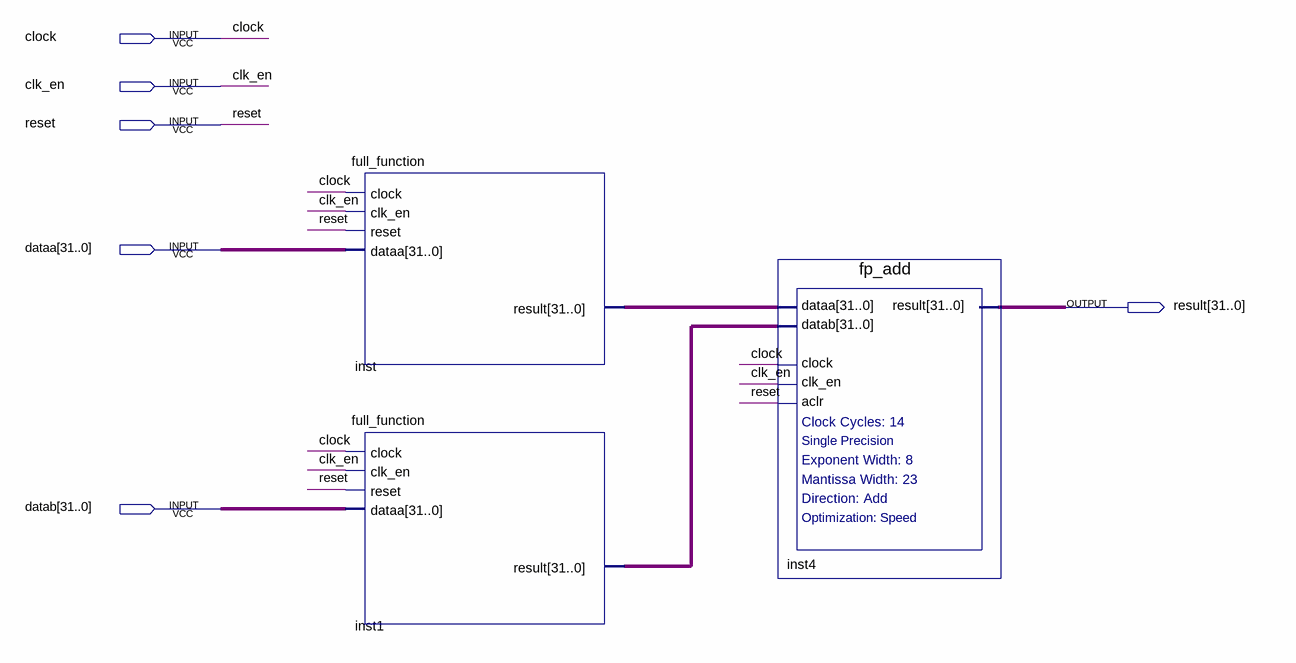
[diagram p0: schematic sheet]
// Quartus schematic parallel_hw.bdf as structural Verilog: 3 symbols, 6 pins
module parallel_hw (
  input  clock,
  input  clk_en,
  input  reset,
  input  [31:0] dataa,
  input  [31:0] datab,
  output [31:0] result
);

  wire [31:0] inst1_result, inst_result;

  full_function inst (.clk_en(clk_en), .clock(clock), .dataa(dataa), .reset(reset), .result(inst_result));
  full_function inst1 (.clk_en(clk_en), .clock(clock), .dataa(datab), .reset(reset), .result(inst1_result));
  fp_add inst4 (
    .dataa(inst_result), .datab(inst1_result), .clock(clock), .clk_en(clk_en), .aclr(reset), .result(result));
endmodule
